# EAGLE board nixie_clock (EAGLE 9.5.1)
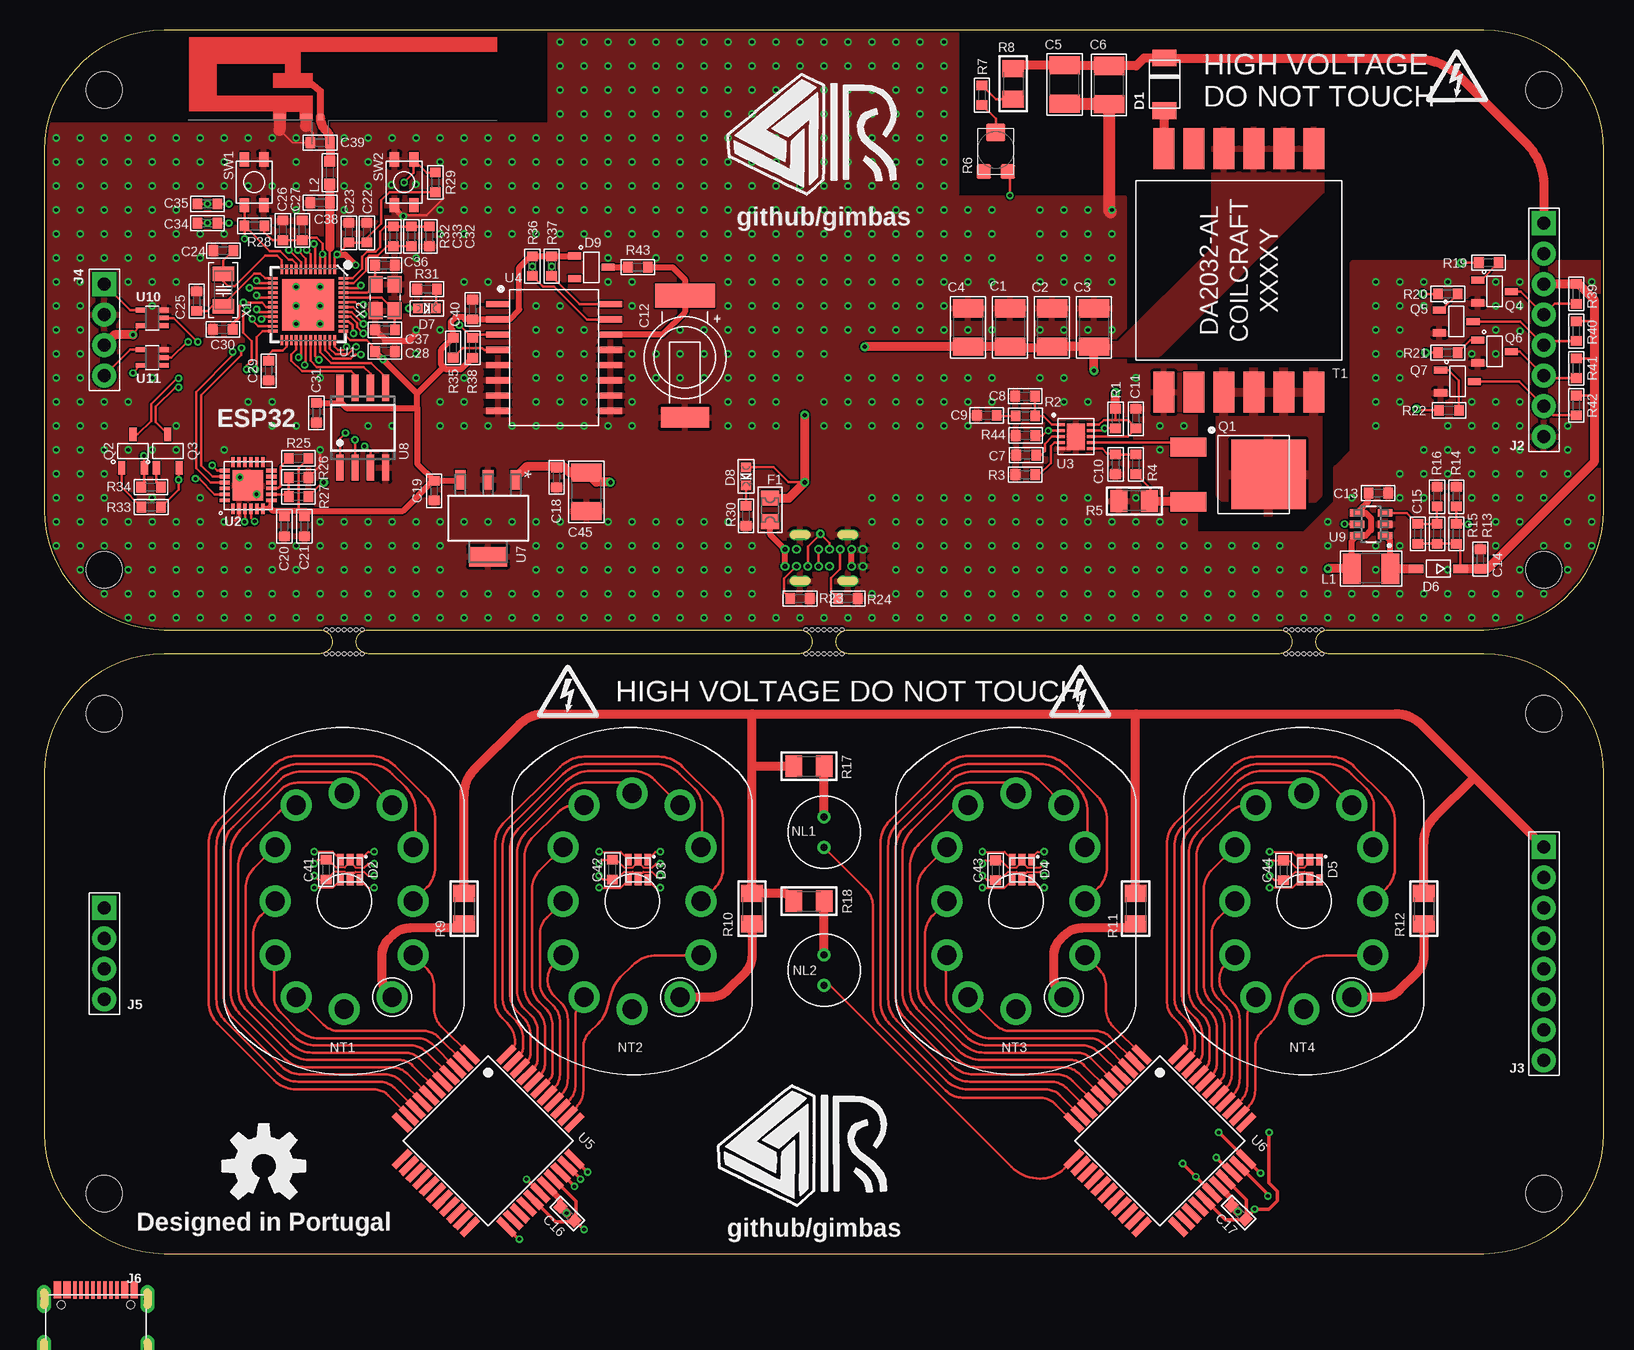
[diagram p4: board, top side]
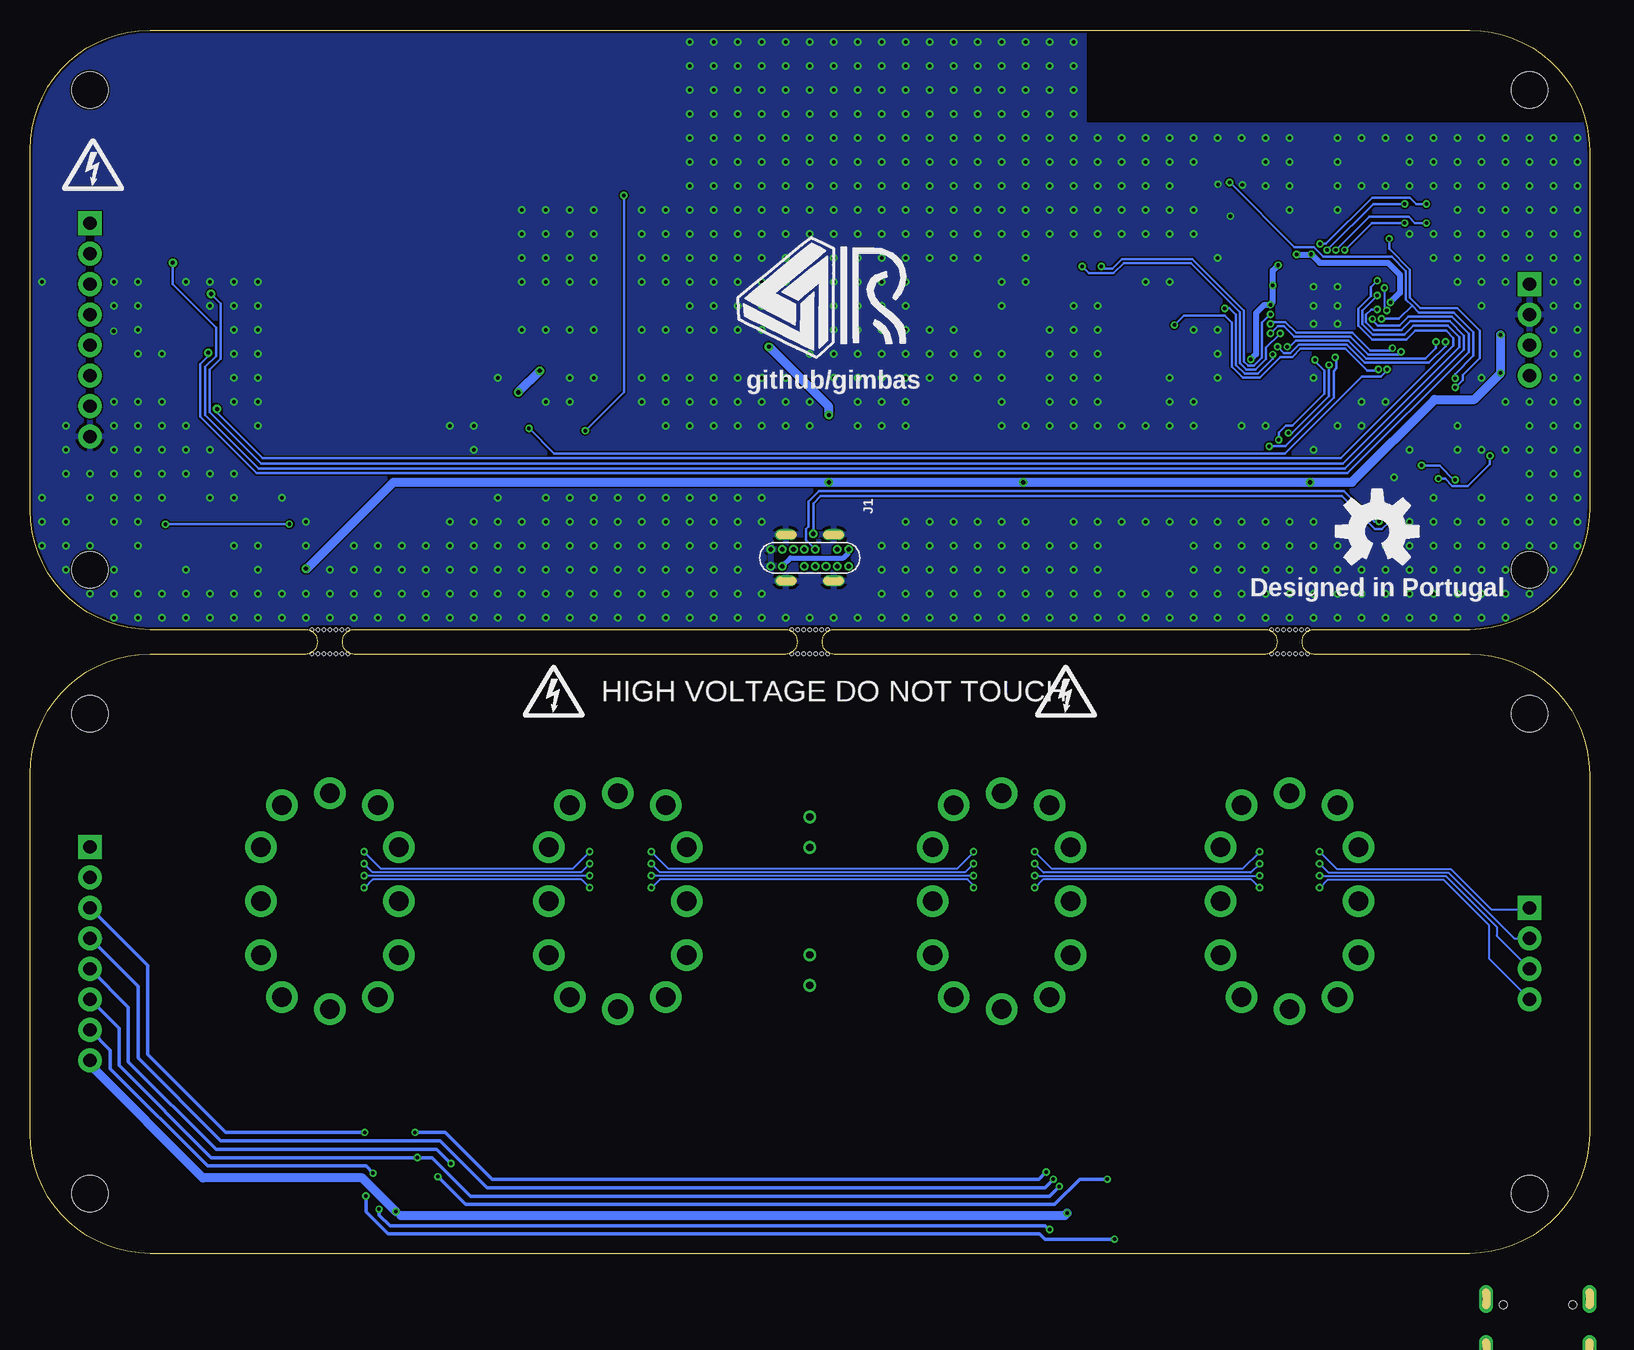
[diagram p5: board, bottom side, seen from below]

Size 130 x 102 mm. Coordinates in mm from the lower left corner, seen from the top.
Outline: 0,40 0,10 arc90 10,0 120,0 arc90 130,10 130,40 arc90 120,50 107,50 arc-180 107,52 120,52 arc90 130,62 130,92 arc90 120,102 10,102 arc90 0,92 0,62 arc90 10,52 23,52 arc-180 23,50 10,50 arc90 0,40
Outline: 103,50 67,50 arc-180 67,52 103,52 arc-180 103,50
Outline: 63,50 27,50 arc-180 27,52 63,52 arc-180 63,50
Copper layers (1*16): Top 0.035mm / dielectric 1.2mm / Bottom 0.035mm
Design rules "jlcpcb-2l-dr": minimum track width 5mil, minimum drill 0.3mm, track to track 5mil, track to pad 5mil, pad to pad 5mil, via to via 5mil, smd to smd 5mil, copper to edge 0.2mm, drill to drill 5mil, minimum pad ring 3mil, minimum via ring 3mil, stop-mask expansion 4mil, vias tented up to drill 0.5mm, thermal gap 10mil
Holes 3 mm at 5,5 5,45 125,45 125,5 5,57 5,97 125,97 125,57
Holes 0.3 mm at 23.5,50 24,50 24.5,50 25,50 25.5,50 26,50 26.5,50 26.5,52 26,52 25.5,52 25,52 24.5,52 24,52 23.5,52 63.5,50 64,50 64.5,50 65,50 65.5,50 66,50 66.5,50 66.5,52 66,52 65.5,52 65,52 64.5,52 64,52 63.5,52 103.5,52 104,52 104.5,52 105,52 105.5,52 106,52 106.5,52 106.5,50 106,50 105.5,50 105,50 104.5,50 104,50 103.5,50
tRestrict: area -1,94.3 to 41.9,105.1
bRestrict: area -1,94.3 to 41.9,105.1

## Footprints (pad centres in the part's own frame; a part is rotated, then mirrored left to right if it is on the bottom)
_1210 = smd 1.52 x 2.54: 1 -1.6,0; 2 1.6,0
0603_WAVE = smd 0.8 x 0.9: P$1 -0.823,0; P$2 0.823,0
DSK-614/621 = smd 5 x 2: 1 0,5.15 | smd 4 x 1.7: 2 0,-5
SOD-128 = smd 1.4 x 2: AN 2.2,0; CAT -2.2,0
2020 = smd 0.95 x 0.55: 1 -0.85,0.8; 2 -0.85,0; 3 -0.85,-0.8; 4 0.85,-0.8; 6 0.85,0.8 | smd 1.15 x 0.55: 5 0.75,0
SOD-123 = smd 1.2 x 0.7: A 1.85,0; C -1.85,0
CHIPLED_0603 = smd 0.8 x 0.8: A 0,-0.75; C 0,0.75
SOT-23-3 = smd 0.6 x 1.1: P$1 -0.95,-1.4; P$2 0.95,-1.4; P$3 0,1.4
TRACE_ANTENNA_2.4GHZ_25.7MM = smd 0.46 x 0.46: ANT 0,0.23 | smd 1 x 0.46: GND -1.18,0.23; GND2 -3.38,0.23
0805 = smd 1.245 x 1.473: 1 -0.965,0; 2 0.965,0
USB-C-V = drill 0.4 pad 0.6: A1 -3.25,0.7; A4 -2.3,0.7; A5 -1.35,0.7; A6 -0.45,0.7; A7 0.45,0.7; A8 2.3,0.7; A9 3.25,0.7; B4 3.25,-0.7; B5 2.3,-0.7; B6 1.35,-0.7; B7 0.45,-0.7; B8 -0.45,-0.7; B9 -2.3,-0.7; B12 -3.25,-0.7 | drill 0.5 long: SHIELD0 2,1.93; SHIELD1 -2,1.93; SHIELD2 -2,-1.93; SHIELD3 2,-1.93
1X8_2.54 = drill 1.1 square: 1 -8.89,0 | drill 1.1: 2 -6.35,0; 3 -3.81,0; 4 -1.27,0; 5 1.27,0; 6 3.81,0; 7 6.35,0; 8 8.89,0
1X4_2.54 = drill 1.1 square: 1 -3.81,0 | drill 1.1: 2 -1.27,0; 3 1.27,0; 4 3.81,0
USB-C = smd 0.6 x 1.4: A1/B12 -3.2,7.276; A4/B9 -2.4,7.276; B1/A12 3.2,7.276; B4/A9 2.4,7.276 | smd 0.3 x 1.45: A5 -1.25,7.251; A6 -0.25,7.251; A7 0.25,7.251; A8 -1.75,7.251; B5 1.75,7.251; B6 0.75,7.251; B7 -0.75,7.251; B8 1.27,7.251 | drill 0.65 pad 1 long: SHIELD0 -4.32,6.526; SHIELD1 -4.32,2.346; SHIELD2 4.32,2.346; SHIELD3 4.32,6.526 | hole 0.65: -2.89,6.026; 2.89,6.026
_0603 = smd 0.9 x 0.9: 1 -0.95,0; 2 0.95,0
NL-6X16 = drill 0.6: 1 0,1.27; 2 0,-1.27
IN-12 = drill 1.6: 0 5.75,-4.5; 1 -4,-8; 2 -5.75,-4.5; 3 -5.75,0; 4 -5.75,4.5; 5 -4,8; 6 0,9; 7 4,8; 8 5.75,4.5; 9 5.75,0; A 4,-8; LHDP 0,-9
D-PAK = smd 1.6 x 3: L -2.285,-3.34; R 2.285,-3.34 | smd 5.8 x 6.2: P 0,3.34
_1206 = smd 1.4 x 1.8: 1 -1.27,0; 2 1.27,0
TC33X = smd 1.2 x 1.2: 1 -1,-1.8; 3 1,-1.8 | smd 1.6 x 1.5: 2 0,1.45
3X4X2 = smd 1.2 x 0.8: 1 -1.9,0.8; 2 1.9,0.8; 3 1.9,-0.8; 4 -1.9,-0.8
DA2032-AL = smd 3.43 x 1.79: 1 -10.155,6.25; 2 -10.155,3.75; 3 -10.155,1.25; 4 -10.155,-1.25; 5 -10.155,-3.75; 6 -10.155,-6.25; 7 10.155,-6.25; 8 10.155,-3.75; 9 10.155,-1.25; 10 10.155,1.25; 11 10.155,3.75; 12 10.155,6.25
QFN48-0.4MM = smd 0.8 x 0.23: 1 -2.95,2.2; 2 -2.95,1.8; 3 -2.95,1.4; 4 -2.95,1; 5 -2.95,0.6; 6 -2.95,0.2; 7 -2.95,-0.2; 8 -2.95,-0.6; 9 -2.95,-1; 10 -2.95,-1.4; 11 -2.95,-1.8; 12 -2.95,-2.2; 25 2.95,-2.2; 26 2.95,-1.8; 27 2.95,-1.4; 28 2.95,-1; 29 2.95,-0.6; 30 2.95,-0.2; 31 2.95,0.2; 32 2.95,0.6; 33 2.95,1; 34 2.95,1.4; 35 2.95,1.8; 36 2.95,2.2 | smd 0.23 x 0.8: 13 -2.2,-2.95; 14 -1.8,-2.95; 15 -1.4,-2.95; 16 -1,-2.95; 17 -0.6,-2.95; 18 -0.2,-2.95; 19 0.2,-2.95; 20 0.6,-2.95; 21 1,-2.95; 22 1.4,-2.95; 23 1.8,-2.95; 24 2.2,-2.95; 37 2.2,2.95; 38 1.8,2.95; 39 1.4,2.95; 40 1,2.95; 41 0.6,2.95; 42 0.2,2.95; 43 -0.2,2.95; 44 -0.6,2.95; 45 -1,2.95; 46 -1.4,2.95; 47 -1.8,2.95; 48 -2.2,2.95 | smd 4.3 x 4.3: EP 0,0
QFN24 = smd 0.3 x 0.85: 1 -1.25,-1.95; 2 -0.75,-1.95; 3 -0.25,-1.95; 4 0.25,-1.95; 5 0.75,-1.95; 6 1.25,-1.95; 13 1.25,1.95; 14 0.75,1.95; 15 0.25,1.95; 16 -0.25,1.95; 17 -0.75,1.95; 18 -1.25,1.95 | smd 0.85 x 0.3: 7 1.95,-1.25; 8 1.95,-0.75; 9 1.95,-0.25; 10 1.95,0.25; 11 1.95,0.75; 12 1.95,1.25; 19 -1.95,1.25; 20 -1.95,0.75; 21 -1.95,0.25; 22 -1.95,-0.25; 23 -1.95,-0.75; 24 -1.95,-1.25 | smd 2.55 x 2.55: PAD 0,0
DFN10-2 = smd 0.7 x 0.25: 1 -1.25,1; 2 -1.25,0.5; 3 -1.25,0; 4 -1.25,-0.5; 5 -1.25,-1; 6 1.25,-1; 7 1.25,-0.5; 8 1.25,0; 9 1.25,0.5; 10 1.25,1 | smd 1.5 x 2.2: 11 0,0
SOIC-16 = smd 1.98 x 0.53: 1 -4.685,4.445; 2 -4.685,3.175; 3 -4.685,1.905; 4 -4.685,0.635; 5 -4.685,-0.635; 6 -4.685,-1.905; 7 -4.685,-3.175; 8 -4.685,-4.445; 9 4.685,-4.445; 10 4.685,-3.175; 11 4.685,-1.905; 12 4.685,-0.635; 13 4.685,0.635; 14 4.685,1.905; 15 4.685,3.175; 16 4.685,4.445
QFP64 = smd 1.9 x 0.55: 1 -6.15,4; 2 -6.15,3.2; 3 -6.15,2.4; 4 -6.15,1.6; 5 -6.15,0.8; 6 -6.15,0; 7 -6.15,-0.8; 8 -6.15,-1.6; 9 -6.15,-2.4; 10 -6.15,-3.2; 11 -6.15,-4; 23 6.15,-4; 24 6.15,-3.2; 25 6.15,-2.4; 26 6.15,-1.6; 27 6.15,-0.8; 28 6.15,0; 29 6.15,0.8; 30 6.15,1.6; 31 6.15,2.4; 32 6.15,3.2; 33 6.15,4 | smd 0.55 x 1.9: 12 -4,-6.15; 13 -3.2,-6.15; 14 -2.4,-6.15; 15 -1.6,-6.15; 16 -0.8,-6.15; 17 0,-6.15; 18 0.8,-6.15; 19 1.6,-6.15; 20 2.4,-6.15; 21 3.2,-6.15; 22 4,-6.15; 34 4,6.15; 35 3.2,6.15; 36 2.4,6.15; 37 1.6,6.15; 38 0.8,6.15; 39 0,6.15; 40 -0.8,6.15; 41 -1.6,6.15; 42 -2.4,6.15; 43 -3.2,6.15; 44 -4,6.15
SOT230P700X180-4N = smd 1.626 x 0.889: 1 -3.2,2.311; 2 -3.2,0; 3 -3.2,-2.311 | smd 1.626 x 3.175: 4 3.2,0
SO08-SS = smd 0.6 x 2.2: 1 -1.905,-3.33; 2 -0.635,-3.33; 3 0.635,-3.33; 4 1.905,-3.33; 5 1.905,3.33; 6 0.635,3.33; 7 -0.635,3.33; 8 -1.905,3.33
SOT-23-6N = smd 1.219 x 0.6: 1 -1.168,0.95; 2 -1.168,0; 3 -1.168,-0.95; 4 1.168,-0.95; 5 1.168,0; 6 1.168,0.95
SC70-5 = smd 0.4 x 0.75: 1 -0.65,-1; 2 0,-1; 3 0.65,-1; 4 0.65,1; 5 -0.65,1
2-SMD-3215 = smd 1.2 x 1.8: 1 -1.35,0; 2 1.35,0
4-SMD-3225 = smd 1.4 x 1.15: 1 -1.1,0.8; 2 1.1,0.8; 3 1.1,-0.8; 4 -1.1,-0.8

## Placement (x,y rotation side)
C1  47u  [_1210]  80.5,77.2 90 top
C2  47u  [_1210]  84,77.2 90 top
C3  47u  [_1210]  87.5,77.2 90 top
C4  47u  [_1210]  77,77.2 90 top
C5  200V 470n  [_1210]  85.05,97.46 270 top
C6  200V 470n  [_1210]  88.75,97.41 270 top
C7  100n  [0603_WAVE]  81.85,66.57 180 top
C8  100p  [0603_WAVE]  81.76,71.47 180 top
C9  22n  [0603_WAVE]  78.57,69.87 180 top
C10  10n  [0603_WAVE]  89.3,65.8 270 top
C11  10u  [0603_WAVE]  91,69.6 90 top
C12  0.22F  [DSK-614/621]  53.4,74.7 0 top
C13  1u  [0603_WAVE]  111.2,63.4 0 top
C14  1u  [0603_WAVE]  119.7,57.9 90 top
C15  22n  [0603_WAVE]  114.5,60 90 top
C16  100n  [0603_WAVE]  43.6,3.32 135 top
C17  100n  [0603_WAVE]  99.55,3.43 135 top
C18  1u  [0603_WAVE]  42.7,64.7 270 top
C19  1u  [0603_WAVE]  32.5,63.6 270 top
C20  100n  [0603_WAVE]  20.01,60.63 270 top
C21  4u7  [0603_WAVE]  21.69,60.63 270 top
C22  100p  [0603_WAVE]  26.9,85.1 90 top
C23  100n  [0603_WAVE]  25.4,85.1 90 top
C24  15p  [0603_WAVE]  14.93,83.61 180 top
C25  15p  [0603_WAVE]  12.7,79.4 90 top
C26  100n  [0603_WAVE]  19.9,85.3 90 top
C27  100n  [0603_WAVE]  21.5,85.3 90 top
C28  100n  [0603_WAVE]  28.4,75.2 0 top
C29  100n  [0603_WAVE]  18.7,73.6 270 top
C30  100n  [0603_WAVE]  14.88,77.04 180 top
C31  100n  [0603_WAVE]  22.68,70.09 270 top
C32  10n  [0603_WAVE]  32.1,84.8 270 top
C33  3n3  [0603_WAVE]  30.6,84.8 90 top
C34  270p  [0603_WAVE]  13.6,85.9 180 top
C35  270p  [0603_WAVE]  13.6,87.5 0 top
C36  10p  [0603_WAVE]  28.4,82.4 0 top
C37  10p  [0603_WAVE]  28.4,77 180 top
C38  5p6  [0603_WAVE]  23,87.6 180 top
C39  2p4  [0603_WAVE]  23,92.6 180 top
C40  100n  [0603_WAVE]  35.7,78.7 90 top
C41  [0603_WAVE]  23.5,32 90 top
C42  [0603_WAVE]  47.35,32 90 top
C43  [0603_WAVE]  79.3,31.95 90 top
C44  [0603_WAVE]  103.3,31.95 90 top
C45  47u  [_1210]  45.2,63.5 270 top
D1  RFN1LAM6S  [SOD-128]  93.38,97.47 270 top
D2  SK9822  [2020]  25.5,32 270 top
D3  SK9822  [2020]  49.5,32 270 top
D4  SK9822  [2020]  81.5,32 270 top
D5  SK9822  [2020]  105.5,32 270 top
D6  B0530W  [SOD-123]  116.2,57.1 180 top
D7  LED0603  [CHIPLED_0603]  31.9,78.8 270 top
D8  LED0603  [CHIPLED_0603]  58.5,64.8 180 top
D9  BAT54S  [SOT-23-3]  45.6,82.22 270 top
E1  ANTENNATRACE  [TRACE_ANTENNA_2.4GHZ_25.7MM]  23,94.5 0 top
F1  500mA  [0805]  60.5,62 270 top
J1  USB-CVERTICAL  [USB-C-V]  65,58 0 bottom
J2  8  [1X8_2.54]  125,77 270 top
J3  8  [1X8_2.54]  125,25 270 top
J4  4  [1X4_2.54]  5,77 270 top
J5  4  [1X4_2.54]  5,25 270 top
J6  USB-C  [USB-C]  4.3,-10.3 0 top  (outside the outline)
L1  10u  [_1210]  110.6,57.1 0 top
L2  2n7  [_0603]  23.8,90.1 270 top
LOGO1  HV_WARNING  [HV_WARNING]  88.9,44.7 0 bottom
LOGO2  OSHW-LOGOL  [OSHW-LOGO-L]  17.7,60.2 0 bottom
LOGO3  OSHW-LOGOL  [OSHW-LOGO-L]  18.3,7.3 0 top
LOGO4  HV_WARNING  [HV_WARNING]  41.1,44.7 0 top
LOGO5  HV_WARNING  [HV_WARNING]  46.2,44.7 0 bottom
LOGO6  HV_WARNING  [HV_WARNING]  115.2,96 0 top
LOGO7  HV_WARNING  [HV_WARNING]  127.3,88.6 0 bottom
LOGO13  HV_WARNING  [HV_WARNING]  83.8,44.7 0 top
NL1  NEON6X16  [NL-6X16]  65,35.12 0 top
NL2  NEON6X16  [NL-6X16]  65,23.62 0 top
NT1  IN-12B  [IN-12]  25,29.38 0 top
NT2  IN-12B  [IN-12]  49,29.38 0 top
NT3  IN-12B  [IN-12]  81,29.38 0 top
NT4  IN-12B  [IN-12]  105,29.38 0 top
Q1  IRLR3110ZPBF  [D-PAK]  98.71,64.95 270 top
Q2  BC817-25  [SOT-23-3]  7.4,66.9 0 top
Q3  BC817-25  [SOT-23-3]  10.3,66.9 0 top
Q4  BC817-25  [SOT-23-3]  120.9,80.2 270 top
Q5  BC817-25  [SOT-23-3]  117.7,77.7 270 top
Q6  BC817-25  [SOT-23-3]  120.9,75.2 270 top
Q7  BC817-25  [SOT-23-3]  117.8,72.7 270 top
R1  140k  [0603_WAVE]  89.3,69.6 90 top
R2  10k  [0603_WAVE]  81.79,69.83 0 top
R3  140k  [0603_WAVE]  81.78,64.93 0 top
R4  22  [0603_WAVE]  91,65.8 270 top
R5  20m  [_1206]  90.86,62.73 0 top
R6  100k  [TC33X]  79.32,92 0 top
R7  10k  [0603_WAVE]  78.17,96.56 90 top
R8  1M 200V 0.5%  [_1206]  80.77,97.51 90 top
R9  15k  [_1206]  35,28.75 90 top
R10  15k  [_1206]  59,28.75 90 top
R11  15k  [_1206]  90.97,28.75 90 top
R12  15k  [_1206]  115,28.75 90 top
R13  94k  [0603_WAVE]  117.7,60 270 top
R14  10k  [0603_WAVE]  117.7,63.1 270 top
R15  85k  [0603_WAVE]  116.1,60 270 top
R16  10k  [0603_WAVE]  116.1,63.1 270 top
R17  100k  [_1206]  63.75,40.62 180 top
R18  100k  [_1206]  63.75,29.38 180 top
R19  1k  [0603_WAVE]  120.4,82.6 0 top
R20  94k  [0603_WAVE]  117,80 0 top
R21  1k  [0603_WAVE]  117,75.1 0 top
R22  1k  [0603_WAVE]  117.1,70.3 0 top
R23  5k11  [0603_WAVE]  63,54.6 180 top
R24  5k11  [0603_WAVE]  67,54.6 180 top
R25  10k  [0603_WAVE]  21.2,66.3 0 top
R26  47k5  [0603_WAVE]  21.2,64.7 180 top
R27  22k1  [0603_WAVE]  21.2,63.1 0 top
R28  11k5  [0603_WAVE]  17.52,85.67 0 top
R29  11k5  [0603_WAVE]  32.6,89.3 270 top
R30  1k  [0603_WAVE]  58.5,61.5 90 top
R31  1k  [0603_WAVE]  31.9,80.4 0 top
R32  20k  [0603_WAVE]  29.1,84.8 270 top
R33  10k  [0603_WAVE]  8.91,62.24 0 top
R34  10k  [0603_WAVE]  8.9,63.9 180 top
R35  10k  [0603_WAVE]  34.08,75.51 90 top
R36  4k7  [0603_WAVE]  40.69,82.31 90 top
R37  4k7  [0603_WAVE]  42.3,82.31 90 top
R38  1k  [0603_WAVE]  35.7,75.5 270 top
R39  1k  [0603_WAVE]  127.7,80 90 top
R40  1k  [0603_WAVE]  127.7,76.9 90 top
R41  1k  [0603_WAVE]  127.7,73.8 90 top
R42  1k  [0603_WAVE]  127.7,70.7 90 top
R43  100  [0603_WAVE]  49.49,82.22 180 top
R44  10k  [0603_WAVE]  81.8,68.2 0 top
SW1  [3X4X2]  17.5,89.3 270 top
SW2  [3X4X2]  30,89.3 90 top
T1  DA2032-AL  [DA2032-AL]  99.58,81.95 90 top
U1  ESP32  [QFN48-0.4MM]  22,79.1 270 top
U2  CP2102N  [QFN24]  16.99,64.03 0 top
U3  LT3757  [DFN10-2]  86,68.1 0 top
U4  DS3231  [SOIC-16]  42.5,74.7 0 top
U5  HV5522  [QFP64]  37,9.4 315 top
U6  HV5522  [QFP64]  93,9.4 315 top
U7  MIC39100  [SOT230P700X180-4N]  37,61.3 270 top
U8  W25Q40BVSS  [SO08-SS]  26.55,68.85 0 top
U9  MIC2619  [SOT-23-6N]  110.6,60.8 180 top
U10  74LVC1G17  [SC70-5]  9,78 90 top
U11  74LVC1G17  [SC70-5]  9,74.7 90 top
U$1  [RAFAEL_SILVA_10MM_ALT]  56.2,4 0 top
U$2  [RAFAEL_SILVA_10MM_ALT]  57,88.3 0 top
U$3  [RAFAEL_SILVA_10MM_ALT]  71,74.7 0 bottom
X1  32.768kHz  [2-SMD-3215]  14.92,80.31 270 top
X2  26MHz  [4-SMD-3225]  28.41,79.7 90 top

## Tracks (layer width: path | path; a pad name or v marks a point on that pad's centre or on a via)
3.3V  (via drill 0.3)
  Top 0.2: U1.46 26.2,80.5 v26.4,80.7 | U1.3 23.4,83.11 v23.2,83.31 | U1.4 23,83.11 v23.2,83.31 | v23.2,83.31 23.2,83.61 23.2,84.2 22.7,84.7 21.72,84.7 C27.P$1 C26.P$1 19.02,84.48 18.34,85.16 R28.P$2 | U1.1 24.2,83.08 v24.41,83.29 C23.P$1 C22.P$1 26.87,84.3 26.87,84.64 28.1,85.86 28.1,87.8 28.78,88.48 R29.P$2 | U1.19 18.5,78.9 18.15,79.25 16.65,79.25 v16.6,79.3 | U1.43 25.91,79.3 26.11,79.1 v26.6,79.1 | U1.37 25.15,76.9 25.15,76.48 25.5,76.13 26.87,76.13 27.58,75.42 C28.P$1 | U2.6 18.36,62.2 | U2.7 18.84,62.67 | 18.84,62.24 18.8,62.2 | C20.P$1 19.9,61.56 19.9,61.9 | C21.P$1 21.69,61.79 21.8,61.9 | 21.19,61.9 21.19,65.47 R25.P$2 | U4.2 | 40.53,83.13 R36.P$2
  Top 0.3: U2.5 U2.6 | 18.36,62.2 18.8,62.2 | 18.84,62.67 18.84,62.24 | C30.P$1 15.7,77.54 16.2,78.04 16.2,78.9 v16.6,79.3
  Top 0.5: 18.8,62.2 19.1,61.9 19.9,61.9 21.19,61.9 21.8,61.9 29.9,61.9 32.42,64.42 C19.P$1 | C28.P$1 v28.24,74.54 31.1,71.68 | 31.1,70.5 31.1,71.68 | C31.P$1 24.5,70.91 | 24.5,70.91 24.79,70.91 25.2,70.5 31.1,70.5 | U8.8 24.64,71.06 24.5,70.91 | C40.P$1 U4.2 | R38.P$2 34.72,73.7 33.5,73.7 33.3,73.9 | 33.3,73.9 33.1,74.1 33.1,75.35 R35.P$2 34.08,76.93 33.88,77.13 33.88,77.67 34.28,78.08 34.88,78.08 35.08,77.88 C40.P$1 | 35.57,77.88 C40.P$1 | U4.2 38.77,77.88 39.6,78.7 39.6,82.2 40.53,83.13 | R36.P$2 R37.P$2 44.17,83.13 D9.P$1 | 31.1,71.68 31.1,71.7 33.3,73.9 | 34.69,65.01 U7.3 34.6,64.41 32.52,64.41 C19.P$1 | 31.1,70.5 31.1,65.82 C19.P$1 | v24.41,83.29 25.06,83.29 v25.96,82.4
  Bottom 0.5: v24.41,83.29 23.22,83.29 v23.2,83.31 22.49,82.6 16.8,82.6 15.8,81.6 15.8,80.1 v16.6,79.3 | v28.24,74.54 27.8,74.98 27.8,78.4 27.1,79.1 v26.6,79.1 26.4,79.3 v26.4,80.7 26.4,81.95 v25.96,82.4
5V  (via drill 0.3, 0.35)
  Top 0.2: U11.5 7.4,73.45 v7.4,73.4 | v7.4,76.6 7.4,76.75 U10.5 | U3.8 90.32,68.1 C11.P$1 91.1,68.78 90.38,69.5 89.3,69.5 | 89.3,69.5 88.32,69.5 87.92,69.1 U3.10 | R1.P$2 89.3,69.5 | v23.3,64.3 23.22,64.3 R27.P$2 | D8.A 60.8,65.55 62.05,64.3 v63.4,64.3
  Top 0.5: L1.1 109,59.42 U9.6 110.15,59.85 110.6,60.3 110.6,61.3 110.15,61.75 U9.4 110.33,62.65 110.33,63.35 C13.P$1
  Top 0.75: R1.P$2 v89.3,71.8 | v87.5,73.6 C3.1 C2.1 83.9,75.5 80.6,75.5 C1.1 C4.1 v68.4,75.6 | L1.1 v107,57.1 | v47.2,64.3 46,64.3 C45.1 43.8,65.1 43.3,65.6 42.7,65.6 | U7.1 39.31,64.71 40.2,65.6 42.7,65.6 | C18.P$1 42.7,65.6 | v7.4,76.6 5.87,76.6 J4.3 | v63.4,69.9 v63.4,64.3 62.06,62.97 F1.1
  Bottom 0.75: v89.3,71.8 v87.5,73.6 | v107,57.1 106.9,57.1 99.7,64.3 v63.4,64.3 v47.2,64.3 v23.3,64.3 19.8,64.3 12.9,71.2 9.6,71.2 v7.4,73.4 v7.4,76.6 | v63.4,69.9 63.4,70.6 v68.4,75.6
  pour Top: 97.5,93.7 97.5,83.7 89.6,75.8 84.4,75.8 84.4,75 92.9,75 106.5,88.6 106.5,93.7
12V
  Top 0.2: R39.P$2 127.69,80.81 | 127.8,77.62 R40.P$2 129.18,77.72 129.2,77.7 | D6.C 118.05,58.83 R13.P$2 R15.P$2 C15.P$1 | R42.P$2 129.18,71.52 129.2,71.5 | R41.P$2 129.18,74.62 129.2,74.6
  Top 0.5: 127.89,80.81 127.69,80.81 J2.3
  Top 0.75: 127.89,80.81 127.91,80.81 129.2,79.52 129.2,77.7 129.2,74.6 129.2,71.5 129.2,66 120.28,57.08 C14.P$1 119.68,57.1 D6.C | R39.P$2 125.01,80.82 J2.3
!DSP_BL  (via drill 0.3, 0.35)
  Top 0.2: U1.14 17.9,80.9 v17.7,81.1 | v114.4,70.4 114.5,70.3 R22.P$1
  Bottom 0.2: v17.7,81.1 18.23,80.57 18.23,79.81 19.28,78.75 19.28,77.36 18.09,76.17 15.26,76.17 14.51,76.92 11.96,76.92 11.34,76.3 11.34,75.69 20.73,66.3 110.6,66.3 114.4,70.1 v114.4,70.4
!DSP_BL_HL
  Top 0.2: R42.P$1 125.77,69.88 J2.7 122.95,72.7 Q7.P$3
!DSP_LE  (via drill 0.3, 0.35)
  Top 0.2: U1.21 18.3,78.1 v18.1,77.9 | v115.15,75.1 R21.P$1
  Bottom 0.2: v18.1,77.9 18.1,77.8 17.66,77.36 15.84,77.36 15.1,78.1 11.49,78.1 10.07,76.67 10.07,75.16 20.18,65.05 111.09,65.05 115.8,69.76 115.8,74.14 115.15,74.8 v115.15,75.1
!DSP_LE_HL
  Top 0.2: R41.P$1 125.21,72.98 J2.6 122.99,75.2 Q6.P$3
!HVEN  (via drill 0.3)
  Top 0.2: U1.15 v17.1,80.5 | U3.9 88.2,68.6 v88.4,68.8 89.28,68.8 R1.P$1 | v16.87,73.7 16.87,74.02 17.27,74.42 17.27,76.07 16.58,76.77 16.58,78.31 v16.89,78.62
  Bottom 0.152: v17.1,80.5 17.1,79.51 17.1,78.83 v16.89,78.62
  Bottom 0.2: v88.4,68.8 86.3,66.7 25.4,66.7 19,73.1 17.4,73.1 16.87,73.63 v16.87,73.7
BR2_DSP_CLK_HL  (via drill 0.3)
  Top 0.2: v40.2,6.2 | U6.28
  Top 0.3: U5.28 v40.2,6.2 | U6.28 v96,6.4 v94.9,7.5
  Bottom 0.3: v40.2,6.2 42.5,6.2 44.6,4.1 93.7,4.1 v96,6.4 | J3.5 121.8,20.53 121.8,16 114.5,8.7 96.1,8.7 v94.9,7.5
BRD2_12V  (via drill 0.3)
  Top 0.2: U5.30 42.45,6.18 | C16.P$1 44.26,2.74 | C17.P$1 100.13,2.93
  Top 0.3: U5.27 42.63,2.64 44.08,2.64 C16.P$1 44.31,2.87 44.31,4.35 U5.30 | U6.27 98.47,2.8 100.08,2.8 C17.P$1 100.19,2.91 100.19,4.47 U6.30 | 44.26,2.74 v45,2 | 100.13,2.93 v100.9,3.7 102.1,3.7 102.8,4.4 102.8,5.2 102.1,5.9 v102.1,10.1
  Bottom 0.2: v45,2 45.1,2
  Bottom 0.3: 45.1,2 45.4,2.3 100,2.3 100.9,3.2 v100.9,3.7 | J3.3 120.2,24.01 120.2,16.6 113.7,10.1 v102.1,10.1
BRD2_!DSP_BL_HL  (via drill 0.3)
  Top 0.2: 45.26,6.8 v45.3,6.8 | U6.33 100.12,7.88 | v101.4,6.7 101.36,6.7
  Top 0.3: U5.33 45.26,6.8 | 100.12,7.88 v97.9,10.1 | 101.36,6.7 U6.33
  Bottom 0.3: v45.3,6.8 45.9,6.2 91.5,6.2 95.4,10.1 v97.9,10.1 | J3.7 123.3,16.95 123.3,15.4 115.2,7.3 102,7.3 v101.4,6.7
BRD2_!DSP_LE_HL  (via drill 0.3)
  Top 0.2: v44.19,5.6 v44.2,5.6 | U6.31 98.95,6.75
  Top 0.3: U5.31 v44.19,5.6 | 98.95,6.75 v97.7,8
  Bottom 0.3: v44.2,5.6 45.03,4.77 93.27,4.77 96.5,8 v97.7,8 114.9,8 122.58,15.68 122.58,18.77 J3.6
BRD2_GND2  (via drill 0.3)
  Top 0.2: 99.48,3.5 v99.5,3.5 | v43.54,3.38
  Top 0.508: C16.P$2 43.02,4.51 U5.29 | C17.P$2 98.97,4.56 U6.29
  Top 0.75: C17.P$2 99.48,3.5 | C16.P$2 v43.54,3.38
  Bottom 0.3: v99.5,3.5 99.4,3.5 99.08,3.18
  Bottom 0.75: J3.8 125,15.71 115.59,6.3 102.3,6.3 v99.5,3.5 | v43.54,3.38 43.74,3.18 99.08,3.18
BRD2_SDP_SDI_HL  (via drill 0.3)
  Top 0.2: 44.7,6.22 v44.7,6.2
  Top 0.3: U5.32 44.7,6.22
  Bottom 0.2: 124.07,26.27 J3.4
  Bottom 0.3: v44.7,6.2 45.4,5.5 91.9,5.5 95.8,9.4 114.1,9.4 121,16.3 121,22.27 J3.4
BRD2_VOUT
  Top 0.4: 90.97,44.98 91,45 | 59.12,40.62 59,40.5
  Top 0.75: R9.2 35,38.26 arc-45 35.88,40.38 39.62,44.12 arc-45 41.74,45 59,45 | 119.19,39.7 114.77,44.12 arc45 112.65,45 91,45 59,45 | 119.19,39.7 J3.1 | R11.2 90.97,44.98 | R12.2 115,34.26 arc-45 115.88,36.38 119.19,39.7 | 59,45 59,40.5 R10.2 61.84,30.02 R18.2 | R17.2 59.12,40.62
CHIP_PU  (via drill 0.3)
  Top 0.2: U1.9 | U1.9 21,82.54 20.68,82.86 20.37,82.86 19.67,83.56 18.81,83.56 R28.P$1 16.7,85.7 | 16.7,85.7 SW1.3 | Q3.P$3 9.3,69.3 9.3,70.6 10.9,72.2 v11.2,72.2 | v16.7,84.6 16.7,85.7
  Bottom 0.2: v11.2,72.2 10.58,72.82 10.58,73.23 9.15,74.66 9.15,76.95 11.02,78.83 14.1,78.83 14.97,79.7 14.97,82.03 16.7,83.76 v16.7,84.6
DSP_BL_CLK  (via drill 0.3)
  Top 0.2: v26,75.6 25.96,75.6 25.34,74.97 24.27,74.97 23.8,75.44 U1.35 | v12,76 11.9,76 10.6,74.7 U11.2
  Bottom 0.2: v12,76 12,75.64 13.38,74.26 18.72,74.26 20.23,75.77 24.23,75.77 24.93,75.07 25.47,75.07 v26,75.6
DSP_BL_SDI  (via drill 0.3)
  Top 0.2: U1.36 24.2,75.6 24.5,75.3 24.9,75.3 v25.2,75.6 | U10.2 10.8,78 v12.8,76
  Bottom 0.2: v12.8,76 12.8,75.5 13.7,74.6 18.6,74.6 20.1,76.1 24.47,76.1 24.97,75.6 v25.2,75.6
DSP_CLK  (via drill 0.3, 0.35)
  Top 0.2: U1.17 17.87,79.7 v17.7,79.87 | v114.9,80 R20.P$1
  Bottom 0.2: v17.7,79.87 18.95,78.62 18.95,77.49 18.06,76.59 15.45,76.59 14.71,77.33 11.81,77.33 10.86,76.39 10.86,75.57 20.58,65.85 110.73,65.85 115.02,70.14 115.02,73.7 114.1,74.62 114.1,79.2 v114.9,80
DSP_CLK_HL
  Top 0.2: R40.P$1 125.35,76.08 J2.5 123.03,77.7 Q5.P$3
DSP_SDI  (via drill 0.3, 0.35)
  Top 0.2: U1.20 17.9,78.5 v17.7,78.7 | v118.1,82.6 R19.P$1
  Bottom 0.2: v17.7,78.7 18.2,78.7 18.63,78.27 18.63,77.63 17.97,76.97 15.67,76.97 14.93,77.71 11.65,77.71 10.46,76.52 10.46,75.37 20.38,65.45 110.92,65.45 115.38,69.9 115.38,73.92 114.49,74.81 114.49,77.19 118.1,80.8 v118.1,82.6
DTR  (via drill 0.3)
  Top 0.2: U2.23 14.22,63.27 12.9,64.6 v12.6,64.6 | R34.P$2 8.35,64.17 Q2.P$2 8.35,66.45 v8.3,66.5
  Bottom 0.2: v12.6,64.6 12.04,64.6 11.42,63.97 10.13,63.97 8.3,65.8 v8.3,66.5
FLASH_SCK
  Top 0.2: U8.6 27.18,73.36 26.64,73.9 22.72,73.9 22.2,74.43 U1.31
FLASH_SCS  (via drill 0.3)
  Top 0.2: U1.30 21.8,74.16 v21.71,74.07 | U8.1 24.64,67.94 v25.1,68.4
  Bottom 0.2: v25.1,68.4 24.8,68.4 21.71,71.49 v21.71,74.07
FLASH_SDI
  Top 0.2: U8.5 28.45,73.05 27.26,74.24 23.9,74.24 23,75.14 U1.33
FLASH_SDO  (via drill 0.3)
  Top 0.2: v22.89,74.5 22.6,74.79 U1.32 | U8.2 25.91,67.81 v25.9,67.83
  Bottom 0.2: v25.9,67.83 25.9,68.43 25.3,69.03 24.77,69.03 22.1,71.7 22.1,73.6 22.89,74.39 v22.89,74.5
FLASH_SHD
  Top 0.2: U8.7 25.91,73.23 25.6,73.55 21.49,73.55 20.6,74.44 20.6,74.95 21,75.35 U1.28
FLASH_SWP  (via drill 0.3)
  Top 0.2: U1.29 21.4,74.9 v21.2,74.7 | U8.3 27.18,66.81 v26.7,67.3
  Bottom 0.2: v26.7,67.3 25.37,67.3 21.32,71.35 21.32,73.58 21.11,73.79 21.11,74.61 v21.2,74.7
FLASH_VDD
  Top 0.2: U1.26 20.2,75.6 19.88,75.28 19.06,75.28 18.7,74.92 C29.P$1
GND  (via drill 0.3)
  Top 0.127: 19.62,93.68 20.7,92.6 C39.P$2 22.4,92.82 22.4,93.4 21.82,93.98
  Top 0.2: U2.2 16.24,61.44 15.9,61.1 | U3.5 85.6,67.1 86,67.5 U3.11 | SW2.1 29.2,87.13 | 29.76,86.57 31.87,86.57 33.28,87.98 | R26.P$1 23,65.68 v23,67 | U2.PAD 17.7,63.31 v17.7,63.3 | 28.4,76.18 28.4,76.1
  Top 0.508: 29.76,86.57 29.2,87.13 | C37.P$2 28.4,76.18 | 28.4,76.1 30.4,76.1 31,76.7 v31,77
  Top 1: C5.2 88.7,95.86 C6.2 88.75,86.95 88.9,86.8
  Top 1.016: E1.GND2 19.62,93.68 | E1.GND 21.82,93.98
  other vias: 43,101 45,101 47,101 49,101 51,101 53,101 55,101 57,101 59,101 61,101 63,101 65,101 67,101 69,101 71,101 73,101 75,101 43,99 45,99 47,99 49,99 51,99 53,99 55,99 57,99 59,99 61,99 63,99 65,99 67,99 69,99 71,99 73,99 75,99 43,97 45,97 47,97 49,97 51,97 53,97 55,97 57,97 59,97 61,97 63,97 65,97 67,97 69,97 71,97 73,97 75,97 43,95 45,95 47,95 49,95 51,95 53,95 55,95 57,95 59,95 61,95 63,95 65,95 67,95 69,95 71,95 73,95 75,95 3,93 5,93 7,93 9,93 11,93 13,93 15,93 17,93 19,93 21,93 25,93 27,93 29,93 31,93 33,93 35,93 37,93 39,93 41,93 43,93 45,93 47,93 49,93 51,93 53,93 55,93 57,93 59,93 61,93 63,93 65,93 67,93 69,93 71,93 73,93 75,93 3,91 5,91 7,91 9,91 11,91 13,91 15,91 21,91 25,91 27,91 33,91 35,91 37,91 39,91 41,91 43,91 45,91 47,91 49,91 51,91 53,91 55,91 57,91 59,91 61,91 63,91 65,91 67,91 69,91 71,91 73,91 75,91 3,89 5,89 7,89 9,89 11,89 13,89 15,89 17,89 19,89 21,89 25,89 27,89 28.94,89.08 30.97,89.14 35,89 37,89 39,89 41,89 43,89 45,89 47,89 49,89 51,89 53,89 55,89 57,89 59,89 61,89 63,89 65,89 67,89 69,89 71,89 73,89 75,89 3,87 5,87 7,87 9,87 11,87 21,87 25,87 33,87 35,87 37,87 39,87 41,87 43,87 45,87 47,87 49,87 51,87 53,87 55,87 57,87 59,87 61,87 63,87 65,87 67,87 69,87 71,87 73,87 75,87 77,87 79,87 83,87 85,87 87,87 89,87 3,85 5,85 7,85 9,85 11,85 13,85 15,85 33,85 35,85 37,85 39,85 41,85 43,85 45,85 47,85 49,85 51,85 53,85 55,85 57,85 59,85 61,85 63,85 65,85 67,85 69,85 71,85 73,85 75,85 77,85 79,85 83,85 85,85 87,85 89,85 3,83 5,83 7,83 9,83 11,83 13,83 31,83 47,83 51,83 53,83 55,83 57,83 59,83 61,83 63,83 65,83 67,83 69,83 71,83 73,83 75,83 77,83 79,83 83,83 85,83 87,83 89,83 3,81 7,81 9,81 11,81 21,80.6 23,80.6 35,81 37,81 47,81 49,81 57,81 59,81 61,81 63,81 65,81 67,81 69,81 71,81 73,81 75,81 77,81 79,81 83,81 85,81 87,81 89,81 111,81 113,81 115,81 117,81 121,81 123,81 129,81 3,79 9,79 21,79 23,79 41,79 43,79 49,79 57,79 59,79 61,79 63,79 65,79 67,79 69,79 71,79 73,79 75,79 111,79 113,79 115,79 121,79 123,79 3,77 21,77.5 23,77.5 33,77 41,77 43,77 45,77 53,77 55,77 57,77 59,77 61,77 63,77 65,77 67,77 69,77 71,77 73,77 75,77 77,77 79,77 83,77 85,77 87,77 89,77 111,77 113,77 121,77 123.02,76.89 3,75 31,75 41,75 43,75 45,75 49,75 51,75 53,75 55,75 57,75 59,75 61,75 63,75 65,75 111,75 113,75 119,75 121,75 3,73 9,73 23,73 31,73 35,73 41,73 43,73 45,73 49,73 51,73 53,73 55,73 57,73 59,73 61,73 63,73 67,73 69,73 71,73 73,73 75,73 77,73 79,73 83,73 85,73 91,73 111,73 113,73 3,71 5,71 7,71 17,71 19,71 33,71 35,71 41,71 43,71 45,71 49,71 57,71 59,71 61,71 65,71 67,71 69,71 71,71 73,71 75,71 77,71 79,71 85,71 87,71 111,71 113,71 119,71 121,71 123,71 3,69 5,69 11,69 19,69 21,69 27,69 29,69 33,69 35,69 37,69 39,69 41,69 43,69 45,69 47,69 49,69 57,69 59,69 61,69 65,69 67,69 69,69 71,69 73,69 75,69 77,69 93,69 95,69 111,69 117,69 119,69 121,69 123,69 127,69 3,67 5,67 7,67 9,67 11,67 15,67 93,67 115,67 117,67 119,67 121,67 123,67 127,67 3,65 5,65 16.3,64.7 113,65 115,65 117,65 119,65 121,65 123,65 125,65 127,65 3,63 5,63 9,63 13,63 69,63 71,63 73,63 75,63 77,63 79,63 81,63 83,63 85,63 87,63 91,63 109,63 113,63 115,63 119,63 121,63 123,63 125,63 129,63 3,61 5,61 7,61 9,61 11,61 13,61 15,61 23,61 25,61 27,61 29,61 31,61 33,61 35,61 37,61 39,61 41,61 43,61 47,61 49,61 51,61 53,61 55,61 57,61 69,61 71,61 73,61 75,61 77,61 79,61 81,61 83,61 85,61 87,61 89,61 91,61 93,61 95,61 107,61 121,61 123,61 127,61 129,61 3,59 5,59 7,59 9,59 11,59 13,59 15,59 17,59 19,59 21,59 23,59 25,59 27,59 29,59 31,59 33,59 41,59 43,59 45,59 47,59 49,59 51,59 53,59 55,59 57,59 59,59 71,59 73,59 75,59 77,59 79,59 81,59 83,59 85,59 87,59 89,59 91,59 93,59 95,59 97,59 99,59 101,59 103,59 107,59 111,59 113,59 121,59 125,59 127,59 129,59 3,57 7,57 9,57 11,57 13,57 15,57 17,57 19,57 21,57 23,57 25,57 27,57 29,57 31,57 33,57 41,57 43,57 45,57 47,57 49,57 51,57 53,57 55,57 57,57 59,57 69,55 71,57 73,57 75,57 77,57 79,57 81,57 83,57 85,57 87,57 89,57 91,57 93,57 95,57 97,57 99,57 101,57 103,57 105,57 111,57 117,57 123,57 127,57 5,55 7,55 9,55 11,55 13,55 15,55 17,55 19,55 21,55 23,55 25,55 27,55 29,55 31,55 33,55 35,55 37,55 39,55 41,55 43,55 45,55 47,55 49,55 51,55 53,55 55,55 57,55 59,55 71,55 73,55 75,55 77,55 79,55 81,55 83,55 85,55 87,55 89,55 91,55 93,55 95,55 97,55 99,55 101,55 103,55 105,55 107,55 109,55 111,55 113,55 115,55 117,55 119,55 121,55 123,55 125,55 7,53 9,53 11,53 13,53 15,53 17,53 19,53 21,53 23,53 25,53 27,53 29,53 31,53 33,53 35,53 37,53 39,53 41,53 43,53 45,53 47,53 49,53 51,53 53,53 55,53 57,53 59,53 61,53 63,53 65,53 67,53 69,53 71,53 73,53 75,53 77,53 79,53 81,53 83,53 85,53 87,53 89,53 91,53 93,53 95,53 97,53 99,53 101,53 103,53 105,53 107,53 109,53 111,53 113,53 115,53 117,53 119,53 121,53 123,53 1,93 1,91 1,89 1,87 1,85 1,83 1,81 1,79 1,77 1,75 1,73 1,71 1,69 1,67 1,65 1,63 1,61 1,59 29.94,86.48
  pour Bottom (rank 5): 130,101.85 130,52 0,52 0,94.6 42,94.6 42,102
  pour Top (rank 5): 76,101.95 76,88 90,88 90,74 95.9,74 95.9,60 105.1,60 107.7,62.6 107.7,65.5 109.1,66.9 109.1,82.6 130,82.6 130,52 -0.1,52 -0.1,94.6 41.9,94.6 41.9,102.01
GPIO0-BOOT  (via drill 0.3)
  Top 0.2: U1.23 17.84,77.3 17.34,77.8 v17.34,77.92 | R29.P$1 31.88,90.12 SW2.3 30.8,90.1 v30,89.3 | Q2.P$3 7.8,68.3 8.9,69.4 8.9,70.8 11.06,72.96 v11.2,72.96
  Bottom 0.2: v30,89.3 24.6,83.9 23,83.9 22.2,83.1 16.5,83.1 15.3,81.9 15.3,79.54 14.78,79.02 | 17.32,77.9 v17.34,77.92 15.88,77.92 14.78,79.02 | v11.2,72.96 11.2,73.32 9.67,74.85 9.67,76.82 11.31,78.45 14.22,78.45 14.78,79.02
HFXTAL_N
  Top 0.152: X2.4 29.22,78.59
  Top 0.2: X2.4 28.11,79.7 U1.44 | 29.22,78.59 C37.P$1
HFXTAL_P
  Top 0.2: C36.P$1 27.58,80.83 X2.2 26.91,80.1 U1.45
LED  (via drill 0.3)
  Top 0.2: U1.34 23.4,75.3 24.1,74.6 25.55,74.6 25.9,74.95 v26.4,74.95 | v30.4,78.8 D7.A
  Bottom 0.2: v26.4,74.95 26.4,74.6 27.67,73.33 28.74,73.33 29.48,74.07 29.48,78.28 30,78.8 v30.4,78.8
LED_GND  (via drill 0.3)
  Top 0.152: v22.5,32.5 22.82,32.82 C41.P$2 23.69,32.82 24.34,32.17 25.06,32.17 25.48,32.59 25.48,32.58 25.5,32.6 D2.2 25.5,32.61 25.94,32.17 26.66,32.17 26.99,32.5 v27.5,32.5 | v46.25,32.5 46.57,32.82 C42.P$2 47.69,32.82 48.34,32.17 49.06,32.17 49.5,32.61 | D3.2 49.5,32.61 | 49.5,32.61 49.94,32.17 50.66,32.17 50.99,32.5 v51.35,32.5 | v78.2,32.5 78.47,32.77 C43.P$2 79.74,32.77 80.34,32.17 81.06,32.17 81.5,32.61 | 81.5,32.61 D4.2 | 81.5,32.61 81.94,32.17 83.01,32.17 83.34,32.5 v83.35,32.5 | v102.15,32.5 102.42,32.77 C44.P$2 103.74,32.77 104.34,32.17 105.06,32.17 105.5,32.61 D5.2 105.5,32.6
  Bottom 0.152: v27.5,32.5 28.24,31.76 45.51,31.76 v46.25,32.5 | v51.35,32.5 52.07,31.78 77.48,31.78 v78.2,32.5 | v83.35,32.5 v83.35,32.49 84.06,31.78 101.44,31.78 v102.15,32.49 v102.15,32.5 | v22.5,32.5 21.76,31.76 11.76,31.76 6.27,26.27 J5.2
LED_VCC  (via drill 0.3)
  Top 0.152: v27.5,31.5 26.99,31.5 26.66,31.83 25.94,31.83 25.52,31.41 25.52,31.27 D2.5 25.48,31.27 25.48,31.41 25.06,31.83 24.15,31.83 C41.P$1 22.82,31.18 v22.5,31.5 | v46.25,31.5 46.57,31.18 C42.P$1 47.69,31.18 48.34,31.83 49.06,31.83 49.5,31.39 | 49.5,31.39 D3.5 | 49.5,31.39 49.94,31.83 50.66,31.83 50.99,31.5 v51.35,31.5 | v78.2,31.5 78.57,31.13 C43.P$1 79.64,31.13 80.34,31.83 81.06,31.83 81.5,31.39 | 81.5,31.39 D4.5 | v83.35,31.5 83.34,31.5 83.01,31.83 81.94,31.83 81.5,31.39 | v102.15,31.5 102.52,31.13 C44.P$1 103.6,31.13 104.3,31.83 105.06,31.83 105.5,31.39 D5.5 105.5,31.35
  Bottom 0.152: v27.5,31.5 27.52,31.48 46.23,31.48 v46.25,31.5 | v51.35,31.5 v78.2,31.5 | v83.35,31.5 v102.15,31.5 | v22.5,31.5 22.45,31.45 22.43,31.47 11.97,31.47 11.95,31.45 7.75,27.25 7.75,26.48 J5.3
LFXTAL_N
  Top 0.2: U1.13 18.4,81.3 18,81.7 17.5,81.7 14.92,79.12 X1.2 14.88,79 14,79 13.58,78.58 C25.P$1
LFXTAL_P
  Top 0.2: U1.12 19.8,82.8 19.4,83.2 18.4,83.2 15.86,80.66 15.32,80.66 14.92,81.06 X1.1 14.92,82.78 C24.P$1
N$1
  Top 0.152: R9.1 34.65,27.13 | 29.04,26.54 28.71,26.21 | 28.71,21.66 NT1.A
  Top 0.75: 34.65,27.13 30.46,27.13 arc45 29.04,26.54 | 28.71,26.21 arc45 28.12,24.8 28.12,23.08 arc45 28.71,21.66
N$2
  Top 0.75: R10.1 59,24.83 arc-45 58.41,23.41 56.96,21.96 arc-45 55.55,21.38 NT2.A
N$3
  Top 0.75: D1.AN 93.33,95.22 T1.12
N$4
  Top 0.2: U3.6 88.2,67.1 88.6,66.7 89.22,66.7 C10.P$1 R4.P$1
N$5
  Top 0.2: U3.7 95.01,67.6 Q1.L
N$6
  Top 1: 100.83,66.17 Q1.P 103.33,66.23
  pour Top: 98,73.5 98,63.3 99.5,61.8 104.7,61.8 106.2,63.3 106.2,73.5
N$7
  Top 0.2: R4.P$2 92.19,63.79 92.19,62.67
  Top 0.5: 92.19,62.67 R5.2
  Top 0.75: Q1.R 92.19,62.67
N$8
  Top 0.2: R7.P$1 79.32,94.59 R6.2
N$9
  Top 0.2: R8.1 79.31,96.24 R7.P$2
N$10
  Top 0.2: U3.1 84,69.1 83.27,69.83 R2.P$2 82.58,69.86 C8.P$1
N$11
  Top 0.2: C9.P$1 79.43,69.83 R2.P$1
N$12
  Top 0.2: U3.3 84,68.1 83.4,67.5 83.4,66.9 83.07,66.57 C7.P$1
N$13
  Top 0.2: U3.4 84.2,67.6 83.9,67.3 83.9,65.9 82.93,64.93 R3.P$2
N$14
  Top 0.152: 91,27.48 90.91,27.39 90.65,27.13
  Top 0.2: R11.1 90.97,27.45 90.91,27.39
  Top 0.75: 90.65,27.13 86.46,27.13 arc45 85.04,26.54 84.71,26.21 arc45 84.12,24.8 84.12,23.08 arc45 84.71,21.66 NT3.A
N$15
  Top 0.75: R12.1 115,24.83 arc-45 114.41,23.41 112.96,21.96 arc-45 111.55,21.38 NT4.A
N$16
  Top 0.5: L1.2 112.2,59.42 U9.1
  Top 0.75: L1.2 D6.A
N$17  (via drill 0.3)
  Top 0.2: v118.7,60.8 118.68,60.82 R13.P$1 R14.P$2 | v108.39,60.81 109.42,60.81 U9.5
  Bottom 0.2: v118.7,60.8 118.69,60.81 v108.39,60.81
N$18
  Top 0.2: U9.3 113.57,61.75 C15.P$2 R15.P$1 R16.P$2
N$19
  Top 0.152: 65,40.6 R17.1
  Top 0.75: NL1.1 65,40.6
N$20
  Top 0.152: 65,29.36 R18.1
  Top 0.75: NL2.1 65,29.36
N$21
  Top 0.2: Q4.P$1 119.77,81.15 R19.P$2
N$22
  Top 0.2: Q5.P$1 116.47,78.65 R20.P$2
N$23  (via drill 0.3)
  Top 0.2: 39.54,1.2 v39.6,1.2
  Top 0.3: U5.23 39.54,1.2 | v102,4.8 102,4.92 U6.32
  Bottom 0.3: v39.6,1.2 45.4,1.2 45.85,1.65 100.15,1.65 102,3.5 v102,4.8
N$24
  Top 0.2: R22.P$2 117.92,72.78 117.05,73.65 Q7.P$1
N$25
  Top 0.2: R21.P$2 118.87,76.15 Q6.P$1
N$26  (via drill 0.3)
  Top 0.152: D2.3 24.05,33.5 v22.5,33.5
  Bottom 0.152: v22.5,33.5 21.04,32.04 11.55,32.04 8.2,28.7 5.11,28.7 J5.1
N$27  (via drill 0.3)
  Top 0.152: D2.4 24.05,30.5 v22.5,30.5
  Bottom 0.152: v22.5,30.5 21.81,31.19 12.19,31.19 8.39,27.39 8.39,24.59 J5.4
N$28
  Top 0.127: 23.82,91.15 23.8,91.15
  Top 0.75: E1.ANT arc45 23.45,93.66 arc-45 23.82,92.74 C39.P$1 23.82,91.15 23.8,91.13 L2.1
N$29
  Top 0.2: U11.4 7.16,75.35 J4.4
N$30
  Top 0.2: U10.4 7.16,78.65 J4.1
N$31
  Top 0.5: D9.P$3 R43.P$2
N$32  (via drill 0.3)
  Top 0.2: R6.3 80.51,90.01 v80.51,88.21 v80.5,88.2 | R44.P$2 83.22,68.2 83.62,68.6 v83.7,68.6 U3.2
  Bottom 0.2: v80.5,88.2 80.5,71.8 v83.7,68.6
N$72  (via drill 0.3)
  Top 0.152: D3.1 50.95,33.5 v51.35,33.5 | v78.2,33.5 80.05,33.5 D4.3
  Bottom 0.152: v51.35,33.5 51.35,33.44 52.72,32.06 76.78,32.06 78.2,33.49 v78.2,33.5
N$73  (via drill 0.3)
  Top 0.152: D3.6 50.95,30.5 v51.35,30.5 | v78.2,30.5 80.05,30.5 D4.4
  Bottom 0.152: v51.35,30.5 51.35,30.7 51.85,31.2 77.5,31.2 v78.2,30.5
N$74
  Top 0.5: J1.B4 J1.A9 60.5,59.95 F1.2 | J1.B9 J1.A4
  Bottom 0.406: J1.B9 66.61,57.99 62.21,57.99 61.75,58.45 J1.A9
N$75
  Top 0.2: J1.B5 61.67,56.27 61.67,55.1 R23.P$2
N$76  (via drill 0.3)
  Top 0.152: D4.6 82.95,30.5 v83.35,30.5 | v102.15,30.5 104.05,30.5 D5.4
  Bottom 0.152: v83.35,30.5 83.35,30.51 84.02,31.19 101.43,31.19 102.11,30.5 v102.15,30.5
N$77  (via drill 0.3)
  Top 0.152: D4.1 82.3,33 82.8,33.5 v83.35,33.5 | v102.15,33.5 104.05,33.5 D5.3
  Bottom 0.152: v83.35,33.5 83.35,33.49 84.77,32.06 100.73,32.06 102.15,33.49 v102.15,33.5
N$78
  Top 0.2: J1.A5 66.35,57.05 65.6,56.3 65.6,55.18 R24.P$2
N$79
  Top 0.2: U2.9 18.96,63.8 19.5,63.8 19.7,64 19.7,65.62 R25.P$1
N$80
  Top 0.2: D8.C R30.P$2
N$81  (via drill 0.3)
  Top 0.152: D2.6 26.35,31.15 27,30.5 v27.5,30.5 | v46.25,30.5 48.05,30.5 D3.4
  Bottom 0.152: v27.5,30.5 28.2,31.2 45.55,31.2 v46.25,30.5
N$82  (via drill 0.3)
  Top 0.152: D2.1 26.35,32.85 27,33.5 v27.5,33.5 | v46.25,33.5 48.05,33.5 D3.3
  Bottom 0.152: v46.25,33.5 44.82,32.07 28.93,32.07 v27.5,33.5
N$83
  Top 0.2: U2.8 20.2,63.27 R27.P$1 R26.P$2
N$84
  Top 0.2: D7.C 32.65,80.33 R31.P$2
N$85
  Top 0.152: 29.08,84 R32.P$2
  Top 0.2: U1.47 25.8,80.9 26.83,81.93 26.83,82.95 27.07,83.19 27.78,83.19 28.59,84 29.08,84 | R32.P$2 C33.P$1
N$86  (via drill 0.3)
  Top 0.2: U1.8 21.41,82.06 21.41,82.63 v20.4,83.64 v20.4,83.65 | v15.4,85.9 C34.P$1
  Bottom 0.2: v20.4,83.65 18.15,85.9 v15.4,85.9
N$87
  Top 0.2: C32.P$1 C33.P$2 R32.P$1 28.42,85.62 28,85.2 28,83.89 27.64,83.53 26.93,83.53 26.5,83.11 26.5,82.1 25.7,81.3 U1.48
N$88  (via drill 0.3)
  Top 0.2: U1.5 22.6,84.04 v22.47,84.17 | v13.6,87.5 C35.P$1
  Bottom 0.2: v13.6,87.5 14.46,87.5 14.98,88.03 18.12,88.03 21.97,84.17 v22.47,84.17
N$89  (via drill 0.3)
  Top 0.2: U1.7 21.8,82.95 21.15,83.6 v21.15,83.65 | v13.6,85.9 C34.P$2
  Bottom 0.2: v13.6,85.9 14.55,85.9 15.08,86.43 18.37,86.43 v21.15,83.65
N$90  (via drill 0.3)
  Top 0.2: U1.6 22.2,83.32 v21.87,83.65 | v15.4,87.5 C35.P$2
  Bottom 0.2: v21.87,83.65 21.67,83.85 21.67,83.87 18.04,87.5 v15.4,87.5
N$91
  Top 0.2: 23.8,83.86 U1.2 | 23.8,88 23.8,87.68 23.8,87.62 C38.P$1
  Top 0.75: 23.8,89.25 23.8,88.8 | 23.8,88.8 23.8,88 23.8,87.68 | 23.8,87.68 23.8,87.62 C38.P$1 | 23.82,87.7 23.8,87.68 | 23.8,87.68 23.8,83.86 | L2.2 23.8,88.8
N$92
  Top 0.2: R33.P$1 6.45,63.88 Q2.P$1
N$93
  Top 0.2: R34.P$1 9.35,64.27 Q3.P$1
N$95
  Top 0.5: R43.P$1 52.38,82.22 53.4,81.2 C12.1 53.4,78.5 51.51,76.61 U4.14
N$96
  Top 0.2: R35.P$1 34.89,75.5 36.5,75.5 36.7,75.3 37.78,75.3 U4.4
NL1
  Top 0.2: NL1.2 68.5,30.35 arc-45 69.09,28.94 69.09,20.47 arc45 69.67,19.05 75.14,13.59 arc45 76.56,13 82.92,13 arc-45 84.33,12.41 U6.11
NL2
  Top 0.2: NL2.2 65.49,22.36 80.62,7.22 arc45 82.99,6.24 arc45 85.03,7.09 U6.12
NT1-0
  Top 0.2: NT1.0 31.91,23.71 arc-45 32.5,22.3 32.5,20.36 arc45 33.09,18.95 U5.1
NT1-1
  Top 0.2: U5.2 32.84,18.06 arc45 31.67,18.55 24.55,18.55 arc-45 23.31,19.07 NT1.1
NT1-2
  Top 0.2: U5.3 32.31,17.46 arc45 31.14,17.95 22.92,17.95 arc-45 21.1,18.7 19.7,20.1 arc-45 19.15,21.43 19.15,24.77 NT1.2
NT1-3
  Top 0.2: U5.4 31.78,16.86 arc45 30.61,17.34 22.64,17.34 arc-45 20.82,18.1 18.18,20.74 arc-45 17.42,22.57 17.42,26.58 arc-45 18.11,28.23 NT1.3
NT1-4
  Top 0.2: U5.5 31.25,16.26 arc45 30.08,16.74 22.36,16.74 arc-45 20.54,17.5 17.53,20.51 arc-45 16.77,22.33 16.77,30.43 arc-45 17.46,32.09 NT1.4
NT1-5
  Top 0.2: U5.6 30.72,15.65 arc45 29.55,16.14 22.09,16.14 arc-45 20.26,16.9 16.91,20.25 arc-45 16.15,22.08 16.15,32.26 arc-45 16.94,34.17 19.55,36.77 arc-45 NT1.5
NT1-6
  Top 0.2: U5.7 30.24,15 arc45 28.95,15.54 21.74,15.54 arc-45 20.03,16.24 16.3,19.97 arc-45 15.55,21.8 15.55,33.38 arc-45 16.34,35.3 19.71,38.66 arc-45 21.12,39.25 24.12,39.25 NT1.6
NT1-7
  Top 0.2: U5.8 29.71,14.4 arc45 28.42,14.94 21.46,14.94 arc-45 19.75,15.64 15.7,19.69 arc-45 14.95,21.52 14.95,33.66 arc-45 15.74,35.57 19.57,39.41 arc-45 21.48,40.2 25.2,40.2 arc-45 26.86,39.52 NT1.7
NT1-8
  Top 0.2: U5.9 29.19,13.8 arc45 27.89,14.33 21.15,14.33 arc-45 19.45,15.04 15.1,19.39 arc-45 14.34,21.21 14.34,33.94 arc-45 15.13,35.85 19.32,40.03 arc-45 21.23,40.83 27,40.83 arc-45 29,40 30.11,38.89 arc-45 30.95,36.85 30.95,34.08 NT1.8
NT1-9
  Top 0.2: U5.10 28.66,13.2 arc45 27.48,13.68 21,13.68 arc-45 19.17,14.44 14.47,19.14 arc-45 13.71,20.96 13.71,34.2 arc-45 14.51,36.11 19.04,40.64 arc-45 21.07,41.48 27.21,41.48 arc-45 29.24,40.64 31.78,38.09 arc-45 32.58,36.18 32.58,32.17 arc-45 31.89,30.52 NT1.9
NT2-0
  Top 0.2: NT2.0 51.12,24.88 arc45 49,24 48.05,23.05 arc29 47.29,21.75 46.91,20.45 arc-29 46.15,19.15 45.47,18.46 arc45 44.94,17.2 44.94,13.62 arc-45 44.35,12.21 U5.35
NT2-1
  Top 0.2: NT2.1 44.88,21.26 arc45 44.3,19.84 44.3,14.11 arc-45 43.71,12.69 U5.36
NT2-2
  Top 0.2: U5.37 43.06,13.18 arc45 43.65,14.59 43.65,19.54 arc45 43.09,20.9 42.49,21.5 arc-45 41.95,22.8 41.95,22.8 arc-45 42.54,24.21 43.2,24.88 NT2.2
NT2-3
  Top 0.2: U5.38 42.42,13.67 arc45 43.01,15.08 43.01,19.26 arc45 42.42,20.68 41.9,21.2 arc-45 41.31,22.61 41.31,26.61 arc-45 41.9,28.02 NT2.3
NT2-4
  Top 0.2: U5.39 42.07,14.45 arc45 42.38,15.18 42.38,19.02 arc45 41.79,20.44 41.26,20.96 arc-45 40.67,22.38 40.67,30.47 arc-45 41.26,31.89 NT2.4
NT2-5
  Top 0.2: U5.40 41.29,14.8 arc45 41.74,15.88 41.74,18.78 arc45 41.15,20.2 40.64,20.71 arc-45 40.05,22.13 40.05,33.17 arc-45 40.64,34.59 42.84,36.79 arc-45 44.25,37.38 NT2.5
NT2-6
  Top 0.2: U5.41 40.77,15.4 arc45 41.14,16.31 41.14,18.48 arc45 40.55,19.9 40.01,20.44 arc-45 39.42,21.85 39.42,33.42 arc-45 40.12,35.09 43.63,38.6 arc-45 45.25,39.27 48.1,39.27 NT2.6
NT2-7
  Top 0.2: U5.42 40.25,16.02 arc45 40.54,16.72 40.54,18.23 arc45 39.95,19.65 39.41,20.19 arc-45 38.83,21.61 38.83,33.72 arc-45 39.52,35.39 43.51,39.38 arc-45 45.54,40.23 49.11,40.23 arc-45 50.89,39.49 NT2.7
NT2-8
  Top 0.2: U5.43 39.68,16.58 arc45 39.9,17.12 39.9,17.97 arc45 39.32,19.39 38.79,19.92 arc-45 38.2,21.33 38.2,33.94 arc-45 38.89,35.61 43.26,39.98 arc-45 45.29,40.83 50.94,40.83 arc-45 52.97,39.98 54.23,38.73 arc-45 54.85,37.23 54.85,33.98 NT2.8
NT2-9
  Top 0.2: NT2.9 54.8,29.38 55.86,30.43 arc45 56.6,32.21 56.6,36.01 arc45 55.76,38.05 53.22,40.58 arc45 51.19,41.42 45.05,41.42 arc45 43.01,40.58 38.27,35.84 arc45 37.58,34.17 37.58,21.06 arc45 38.16,19.64 38.59,19.21 arc-45 39.25,17.63 arc-45 39,17.03 U5.44
NT3-0
  Top 0.2: NT3.0 87.91,23.71 arc-45 88.5,22.3 88.5,20.36 arc45 89.09,18.95 U6.1
NT3-1
  Top 0.2: U6.2 88.84,18.06 arc45 87.67,18.55 80.55,18.55 arc-45 79.31,19.07 NT3.1
NT3-2
  Top 0.2: U6.3 88.31,17.46 arc45 87.14,17.95 78.92,17.95 arc-45 77.1,18.7 75.7,20.1 arc-45 75.15,21.43 75.15,24.77 NT3.2
NT3-3
  Top 0.2: U6.4 87.78,16.86 arc45 86.61,17.34 78.64,17.34 arc-45 76.82,18.1 74.18,20.74 arc-45 73.42,22.57 73.42,26.58 arc-45 74.11,28.23 NT3.3
NT3-4
  Top 0.2: U6.5 87.25,16.26 arc45 86.08,16.74 78.36,16.74 arc-45 76.54,17.5 73.53,20.51 arc-45 72.78,22.33 72.78,30.43 arc-45 73.46,32.09 NT3.4
NT3-5
  Top 0.2: U6.6 86.72,15.65 arc45 85.55,16.14 78.09,16.14 arc-45 76.26,16.9 72.91,20.25 arc-45 72.15,22.08 72.15,32.26 arc-45 72.94,34.17 75.55,36.77 arc-45 NT3.5
NT3-6
  Top 0.2: U6.7 86.24,15 arc45 84.95,15.54 77.74,15.54 arc-45 76.03,16.24 72.3,19.97 arc-45 71.55,21.8 71.55,33.38 arc-45 72.34,35.3 75.71,38.66 arc-45 77.12,39.25 80.12,39.25 NT3.6
NT3-7
  Top 0.2: U6.8 85.72,14.4 arc45 84.42,14.94 77.46,14.94 arc-45 75.75,15.64 71.7,19.69 arc-45 70.94,21.52 70.94,33.66 arc-45 71.74,35.57 75.57,39.41 arc-45 77.48,40.2 81.2,40.2 arc-45 82.86,39.52 NT3.7
NT3-8
  Top 0.2: U6.9 85.19,13.8 arc45 83.89,14.33 77.15,14.33 arc-45 75.45,15.04 71.1,19.39 arc-45 70.34,21.21 70.34,33.94 arc-45 71.14,35.85 75.31,40.03 arc-45 77.23,40.83 83,40.83 arc-45 85,40 86.11,38.89 arc-45 86.95,36.85 86.95,34.08 NT3.8
NT3-9
  Top 0.2: U6.10 84.66,13.2 arc45 83.48,13.68 77,13.68 arc-45 75.17,14.44 70.47,19.14 arc-45 69.72,20.96 69.72,34.2 arc-45 70.51,36.11 75.04,40.64 arc-45 77.07,41.48 83.21,41.48 arc-45 85.24,40.64 87.78,38.09 arc-45 88.58,36.18 88.58,32.17 arc-45 87.89,30.52 NT3.9
NT4-0
  Top 0.2: NT4.0 107.12,24.88 arc45 105,24 104.05,23.05 arc29 103.29,21.75 102.91,20.45 arc-29 102.15,19.15 101.47,18.46 arc45 100.94,17.2 100.94,13.62 arc-45 100.35,12.21 U6.35
NT4-1
  Top 0.2: NT4.1 100.88,21.26 arc45 100.3,19.84 100.3,14.11 arc-45 99.71,12.69 U6.36
NT4-2
  Top 0.2: U6.37 99.06,13.18 arc45 99.65,14.59 99.65,19.54 arc45 99.09,20.9 98.49,21.5 arc-45 97.95,22.8 97.95,22.8 arc-45 98.54,24.21 99.2,24.88 NT4.2
NT4-3
  Top 0.2: U6.38 98.42,13.67 arc45 99,15.08 99,19.26 arc45 98.42,20.68 97.9,21.2 arc-45 97.31,22.61 97.31,26.61 arc-45 97.9,28.02 NT4.3
NT4-4
  Top 0.2: U6.39 98.07,14.45 arc45 98.38,15.18 98.38,19.02 arc45 97.79,20.44 97.26,20.96 arc-45 96.67,22.38 96.67,30.47 arc-45 97.26,31.89 NT4.4
NT4-5
  Top 0.2: U6.40 97.29,14.8 arc45 97.74,15.88 97.74,18.78 arc45 97.15,20.2 96.64,20.71 arc-45 96.05,22.13 96.05,33.17 arc-45 96.64,34.59 98.84,36.79 arc-45 100.25,37.38 NT4.5
NT4-6
  Top 0.2: U6.41 96.77,15.4 arc45 97.14,16.31 97.14,18.48 arc45 96.55,19.9 96.01,20.44 arc-45 95.42,21.85 95.42,33.42 arc-45 96.12,35.09 99.63,38.6 arc-45 101.25,39.27 104.1,39.27 NT4.6
NT4-7
  Top 0.2: U6.42 96.25,16.02 arc45 96.54,16.72 96.54,18.23 arc45 95.95,19.65 95.41,20.19 arc-45 94.83,21.61 94.83,33.72 arc-45 95.52,35.39 99.51,39.38 arc-45 101.54,40.23 105.11,40.23 arc-45 106.89,39.49 NT4.7
NT4-8
  Top 0.2: U6.43 95.68,16.58 arc45 95.9,17.12 95.9,17.97 arc45 95.32,19.39 94.79,19.92 arc-45 94.2,21.33 94.2,33.94 arc-45 94.89,35.61 99.26,39.98 arc-45 101.29,40.83 106.94,40.83 arc-45 108.97,39.98 110.23,38.73 arc-45 110.85,37.23 110.85,33.98 NT4.8
NT4-9
  Top 0.2: NT4.9 110.8,29.38 111.86,30.43 arc45 112.6,32.21 112.6,36.01 arc45 111.76,38.05 109.22,40.58 arc45 107.19,41.42 101.05,41.42 arc45 99.01,40.58 94.27,35.84 arc45 93.58,34.17 93.58,21.06 arc45 94.16,19.64 94.59,19.21 arc-45 95.25,17.63 arc-45 95,17.03 U6.44
RTC_INT  (via drill 0.3)
  Top 0.2: U1.24 18.2,76.9 17.7,76.4 17.7,73.8 v17.6,73.7 | U4.3 35.98,76.61 R38.P$1 34.62,77.4 v34.6,77.4
  Bottom 0.2: v34.6,77.4 33.8,78.2 30.4,78.2 29.81,77.61 29.81,73.94 28.88,73.01 27.49,73.01 25.75,74.75 24.79,74.75 24.1,75.44 20.37,75.44 18.52,73.6 17.7,73.6 v17.6,73.7
RTS  (via drill 0.3)
  Top 0.2: U2.19 14.43,65.28 v14,65.7 | Q3.P$2 11.2,65.45 v11.2,64.5 11.2,63.71 R33.P$2
  Bottom 0.2: v14,65.7 12.5,65.7 11.3,64.5 v11.2,64.5
SCL  (via drill 0.3)
  Top 0.2: U1.39 25.38,77.71 25.7,77.39 25.7,76.7 v25.78,76.7 | v42.3,82.3 R37.P$1 44.64,79.14 U4.16
  Bottom 0.2: v25.78,76.7 26.97,75.5 26.97,74.55 27.84,73.68 28.59,73.68 29.13,74.22 29.13,78.47 33.23,82.57 38.83,82.57 39.67,81.73 41.73,81.73 v42.3,82.3
SDA  (via drill 0.3)
  Top 0.2: U1.42 25.77,78.9 26.36,78.3 v26.6,78.3 | U4.15 45.26,77.88 42.52,80.61 41.56,80.61 41.48,80.7 R36.P$1 v40.69,82.29 v40.7,82.3
  Bottom 0.2: v26.6,78.3 27.3,77.6 27.3,74.7 27.99,74.01 28.46,74.01 28.8,74.36 28.8,78.6 33.1,82.9 38.96,82.9 39.76,82.1 40.5,82.1 v40.7,82.3
SDP_SDI_HL
  Top 0.2: R39.P$1 125.91,79.18 J2.4 123.07,80.2 Q4.P$3
U0RXD  (via drill 0.3)
  Top 0.2: v26.6,76.7 26.06,77.24 26.06,77.56 25.52,78.1 U1.40 | U2.21 15.02,64.25 13.89,64.25 12.65,65.49 12.65,71.82 15.71,74.88 v15.71,75.16
  Bottom 0.2: v15.71,75.16 15.94,74.93 16.07,74.93 18.43,74.93 19.93,76.43 24.6,76.43 25.47,77.3 26,77.3 v26.6,76.7
U0TXD  (via drill 0.3)
  Top 0.2: U1.41 25.64,78.5 26.6,77.54 v26.6,77.5 | U2.20 14.03,64.78 13.1,65.7 13.1,71.58 16.43,74.9 v16.43,75.48
  Bottom 0.2: v16.43,75.48 16.65,75.25 18.29,75.25 19.79,76.75 24.45,76.75 25.36,77.66 26.44,77.66 v26.6,77.5
USB_DM  (via drill 0.3)
  Top 0.2: U2.4 17.24,61.32 v17.54,61.03 | J1.A7 J1.B7
  Bottom 0.2: v17.54,61.03 17.93,61.03 20.47,63.56 64.24,63.56 65.12,62.68 65.12,60.59 65.3,60.4 65.3,59.5 64.55,58.75 J1.A7
USB_DP  (via drill 0.3, 0.35)
  Top 0.2: v16.7,61 16.74,61 U2.3 | J1.A6 65.45,59.25 v64.7,60 63.65,58.95 J1.B6
  Bottom 0.2: v16.7,61 17.3,60.4 17.9,60.4 20.65,63.15 62.2,63.15 64.09,63.15 64.7,62.54 v64.7,60
VOUT
  Top 0.75: J2.1 125,89.03 arc45 123.54,92.56 118.1,98 arc45 114.08,99.67 D1.CAT 91.67,99.67 91.02,99.01 C6.1 85.1,99.01 C5.1 81.05,99.06 R8.2

## Text on the board
tPlace: HIGH VOLTAGE / DO NOT TOUCH | github/gimbas | C12 | + | ESP32 | HIGH VOLTAGE DO NOT TOUCH | Designed in Portugal | github/gimbas
bPlace: github/gimbas | Designed in Portugal | HIGH VOLTAGE DO NOT TOUCH